# Altium schematic sheet TemperatureSensor.SchDoc: Temperature Sensor
size 148 x 105 mm; DocumentNumber: 9; SheetNumber: 9; SheetTotal: 10
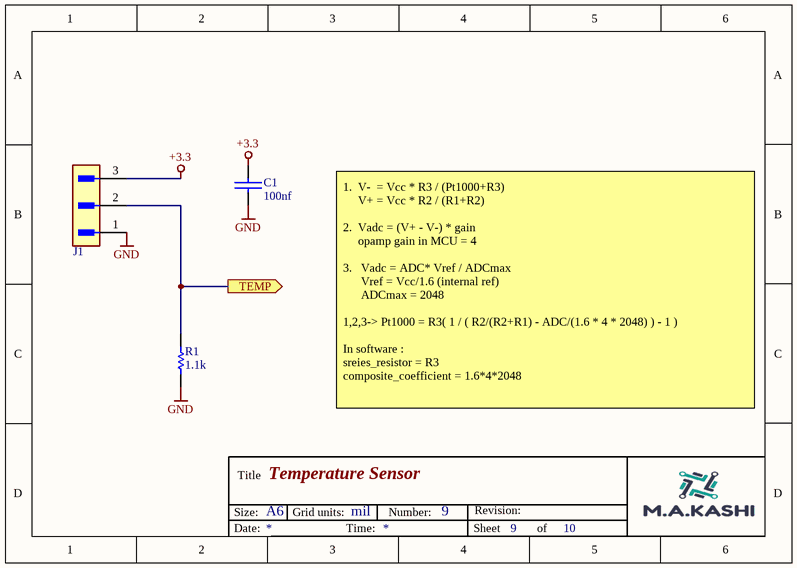
[diagram p0: TemperatureSensor.SchDoc]

## Parts
C1  100nf  [cap_0805_A]
J1  Connector  [Phoenix 3 0D]  (value not drawn)
R1  1.1k  [RES_0805_A]

## Ports
TEMP (out)

## Nets
+3.3: C1.2 J1.3
GND: C1.1 J1.1 R1.1
TEMP: J1.2 R1.2 ; port TEMP

## Notes on the sheet
- 1.  V-  = Vcc * R3 / (Pt1000+R3)
  V+ = Vcc * R2 / (R1+R2)
  2.  Vadc = (V+ - V-) * gain
  opamp gain in MCU = 4
  3.   Vadc = ADC* Vref / ADCmax
  Vref = Vcc/1.6 (internal ref)
  ADCmax = 2048
  1,2,3-> Pt1000 = R3( 1 / ( R2/(R2+R1) - ADC/(1.6 * 4 * 2048) ) - 1 )
  In software :
  sreies_resistor = R3
  composite_coefficient = 1.6*4*2048
- Size:
- Title
- A6
- Grid units:
- mil
- Number:
- Revision:
- Date:
- Time:
- Sheet
- of

## Library data of the parts
C1 = Capacitor: octopart or digikey description!; Part Number: C0402X7R160-104KNE; Capacitance: 100nf; Voltage Rating: *
J1 = Connector 3 pin
R1 = Resistor: octopart or digikey description!; Part Number: RC0402JR-07100RL; Resistance: 1.1k; Voltage Rating: *; Power Rating: *; Tolerance: *